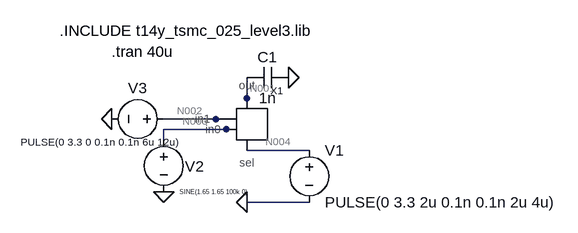
[diagram p0: schematic Draft2.asc]
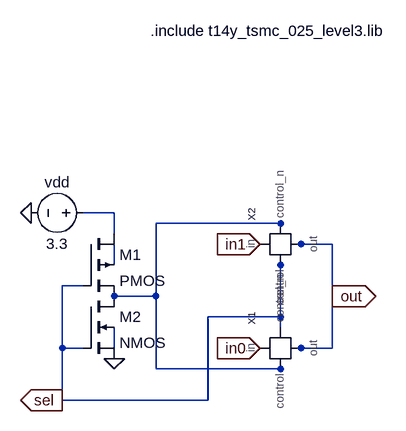
[diagram p1: sub-circuit t_mux.asc]
Draft2.asc, the LTspice schematic file:
Version 4
SHEET 1 880 680
WIRE 208 112 208 80
WIRE 208 128 208 112
WIRE 160 144 80 144
WIRE 192 144 160 144
WIRE 176 160 80 160
WIRE 192 160 176 160
WIRE 80 176 80 160
WIRE 304 192 208 192
WIRE 304 272 208 272
FLAG 0 144 0
FLAG 80 256 0
FLAG 208 272 0
FLAG 272 80 0
SYMBOL voltage 304 176 R0
WINDOW 123 0 0 Left 0
WINDOW 39 0 0 Left 0
SYMATTR InstName V1
SYMATTR Value PULSE(0 3.3 2u 0.1n 0.1n 2u 4u)
SYMBOL voltage 80 160 R0
WINDOW 0 33 57 Left 2
WINDOW 3 24 96 Left 0
WINDOW 123 0 0 Left 0
WINDOW 39 0 0 Left 0
SYMATTR InstName V2
SYMATTR Value SINE(1.65 1.65 100k 0)
SYMBOL voltage 96 144 R90
WINDOW 0 -32 56 VBottom 2
WINDOW 3 25 117 VTop 1
WINDOW 123 0 0 Left 0
WINDOW 39 0 0 Left 0
SYMATTR InstName V3
SYMATTR Value PULSE(0 3.3 0 0.1n 0.1n 6u 12u)
SYMBOL cap 272 64 R90
WINDOW 0 0 32 VBottom 2
WINDOW 3 32 32 VTop 2
SYMATTR InstName C1
SYMATTR Value 1n
SYMBOL t_mux 208 160 R0
SYMATTR InstName X1
TEXT -80 8 Left 2 !.INCLUDE t14y_tsmc_025_level3.lib
TEXT 0 40 Left 2 !.tran 40u

t_mux.asc, the sub-circuit schematic file:
Version 4
SHEET 1 880 680
WIRE -32 80 -80 80
WIRE 224 96 32 96
WIRE -32 112 -32 80
WIRE 224 112 224 96
WIRE 208 128 192 128
WIRE 256 128 240 128
WIRE 304 128 256 128
WIRE -32 160 -32 128
WIRE 224 160 224 144
WIRE -80 192 -112 192
WIRE 32 208 32 96
WIRE 32 208 -32 208
WIRE 304 208 304 128
WIRE 224 240 224 160
WIRE 224 240 112 240
WIRE 224 256 224 240
WIRE -112 288 -112 192
WIRE -80 288 -112 288
WIRE -32 288 -32 256
WIRE 208 288 192 288
WIRE 256 288 240 288
WIRE 304 288 304 208
WIRE 304 288 256 288
WIRE 32 320 32 208
WIRE 224 320 224 304
WIRE 224 320 32 320
WIRE -112 368 -112 288
WIRE 112 368 112 240
WIRE 112 368 -112 368
FLAG -160 80 0
FLAG -32 304 0
FLAG 192 128 in1
IOPIN 192 128 In
FLAG 192 288 in0
IOPIN 192 288 In
FLAG 304 208 out
IOPIN 304 208 Out
FLAG -112 368 sel
IOPIN -112 368 Out
SYMBOL pmos4 -80 112 R0
SYMATTR InstName M1
SYMATTR Value2 l=250n w=40u m=200
SYMBOL nmos4 -80 208 R0
SYMATTR InstName M2
SYMATTR Value2 l=250n w=20u m=200
SYMBOL voltage -64 80 R90
WINDOW 0 -32 56 VBottom 2
WINDOW 3 32 56 VTop 2
WINDOW 123 0 0 Left 0
WINDOW 39 0 0 Left 0
SYMATTR InstName vdd
SYMATTR Value 3.3
SYMBOL tg_gate 224 288 R270
SYMATTR InstName X1
SYMBOL tg_gate 224 128 R270
SYMATTR InstName X2
TEXT 24 -200 Left 2 !.include t14y_tsmc_025_level3.lib

The netlist it stands for:
* Draft2.asc
V1 N004 0 PULSE(0 3.3 2u 0.1n 0.1n 2u 4u)
V2 N003 0 SINE(1.65 1.65 100k 0)
V3 N002 0 PULSE(0 3.3 0 0.1n 0.1n 6u 12u)
C1 0 N001 1n
XX1 N001 N004 N002 N003 t_mux

* block symbol definitions
.subckt t_mux out sel in1 in0
M1 N001 sel N002 N003 PMOS l=250n w=40u m=200
M2 N002 sel 0 N004 NMOS l=250n w=20u m=200
vdd N001 0 3.3
XX1 in0 out N002 sel tg_gate  ; pins in out control control_n
XX2 in1 out sel N002 tg_gate  ; pins in out control control_n
.include t14y_tsmc_025_level3.lib
.ends t_mux

.model NMOS NMOS
.model PMOS PMOS
.lib standard.mos
.INCLUDE t14y_tsmc_025_level3.lib
.tran 40u
.backanno
.end

* Results of the author's LTspice run, read from the files saved beside the schematic
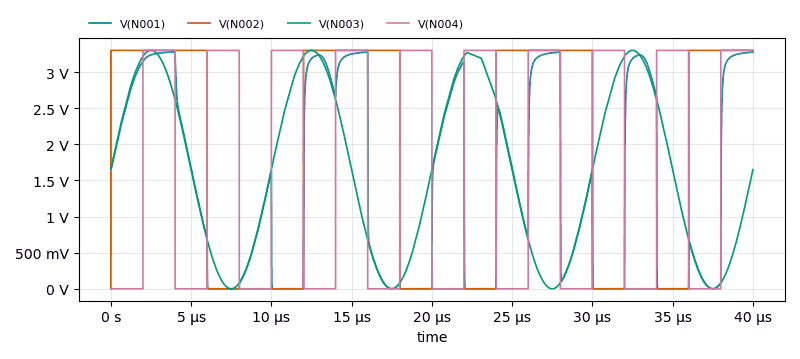
[diagram p2: Transient Analysis of Draft2.asc, plotted from the saved traces]
* Transient Analysis, 1 run:
*   V(N001): min 0 V, max 3.28 V, average 1.457 V, rms 2.011 V, last 3.275 V
*   V(N002): min 0 V, max 3.3 V, average 1.815 V, rms 2.447 V, last 3.3 V
*   V(N003): min 2.031 µV, max 3.3 V, average 1.647 V, rms 2.02 V, last 1.65 V
*   V(N004): min 0 V, max 3.3 V, average 1.65 V, rms 2.333 V, last 3.3 V